# Altium schematic sheet npm1300_qeaa_config4.SchDoc: nPM1300-QEAA Ref. Layout Config. 4
size A4; Revision: 1.2; SheetNumber: 1; SheetTotal: 1; DrawnBy: EISK; DocumentSize: A4; BoardTitle: nPM1300-QEAA Ref. Layout Config. 4; PCAName: nPM1300-QEAA; RefLayoutTitle: Full + High frequency decoupling; Device: nPM1300-QEAA; Classification: PUBLIC; Config: 4
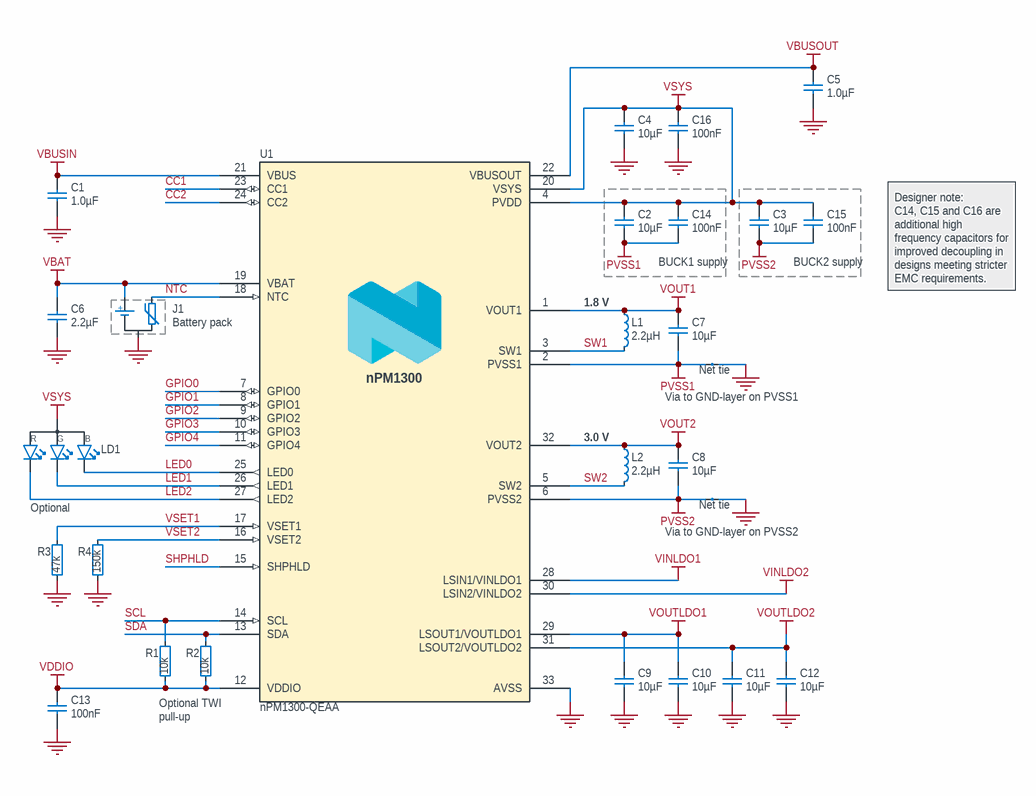
[diagram p0: npm1300_qeaa_config4.SchDoc]

## Parts
C1  1.0µF  [CAPC1608X06L]
C2  10µF  [CAPC1608X06L]
C3  10µF  [CAPC1608X06L]
C4  10µF  [CAPC1608X06L]
C5  1.0µF  [CAPC1608X06L]
C6  2.2µF  [CAPC1608X06L]
C7  10µF  [CAPC1608X06L]
C8  10µF  [CAPC1608X06L]
C9  10µF  [CAPC1608X06L]
C10  10µF  [CAPC1608X06L]
C11  10µF  [CAPC1608X06L]
C12  10µF  [CAPC1608X06L]
C13  100nF  [CAPC0603X03L_C]
C14  100nF  [CAPC1005X04L]
C15  100nF  [CAPC1005X04L]
C16  100nF  [CAPC1005X04L]
J1  Battery pack  [TP_3x1mm_TH]  (graphical)
L1  2.2µH  [INDC2016X10N]
L2  2.2µH  [INDC2016X10N]
LD1  LED RGB  [LED_RGB_0603]  (value not drawn)  (graphical)
NT1  Net tie  [2 PIN STARPOINT]  (net tie, no BOM)
NT2  Net tie  [2 PIN STARPOINT]  (net tie, no BOM)
R1  10k  [RESC0603X03L_C]
R2  10k  [RESC0603X03L_C]
R3  47k  [RESC0603X03L_C]
R4  150k  [RESC0603X03L_C]
U1  nPM1300-QEAA  [Nordic_QFN50P500X500X90-33N]

## Blocks framed on the sheet
BUCK1 supply: C2 C14
BUCK2 supply: C3 C15

## Nets
GND: C1.1 C4.1 C5.1 C6.1 C9.1 C10.1 C11.1 C12.1 C13.2 C16.2 J1.1(GND) NT1.1 NT2.1 R3.2 R4.2 U1.33(AVSS)
PVSS1: C2.1 C7.1 C14.2 NT1.2 U1.2(PVSS1)
PVSS2: C3.1 C8.1 C15.2 NT2.2 U1.6(PVSS2)
VBAT: C6.2 J1.3(V+) U1.19(VBAT)
VBUSIN: C1.2 U1.21(VBUS)
VBUSOUT: C5.2 U1.22(VBUSOUT)
VDDIO: C13.1 R1.2 R2.2 U1.12(VDDIO)
VINLDO1: U1.28(LSIN1/VINLDO1)
VINLDO2: U1.30(LSIN2/VINLDO2)
VOUT1: C7.2 L1.1 U1.1(VOUT1)
VOUT2: C8.2 L2.1 U1.32(VOUT2)
VOUTLDO1: C9.2 C10.2 U1.29(LSOUT1/VOUTLDO1)
VOUTLDO2: C11.2 C12.2 U1.31(LSOUT2/VOUTLDO2)
VSYS: C2.2 C3.2 C4.2 C14.1 C15.1 C16.1 LD1.4(A) U1.4(PVDD) U1.20(VSYS)
CC1: U1.23(CC1)
CC2: U1.24(CC2)
GPIO0: U1.7(GPIO0)
GPIO1: U1.8(GPIO1)
GPIO2: U1.9(GPIO2)
GPIO3: U1.10(GPIO3)
GPIO4: U1.11(GPIO4)
LED0: LD1.3(C_BLUE) U1.25(LED0)
LED1: LD1.2(C_GREEN) U1.26(LED1)
LED2: LD1.1(C_RED) U1.27(LED2)
NTC: J1.2(NTC) U1.18(NTC)
SCL: R1.1 U1.14(SCL)
SDA: R2.1 U1.13(SDA)
SHPHLD: U1.15(SHPHLD)
SW1: L1.2 U1.3(SW1)
SW2: L2.2 U1.5(SW2)
VSET1: R3.1 U1.17(VSET1)
VSET2: R4.1 U1.16(VSET2)

## Notes on the sheet
- (near L1) 1.8 V
- Designer note:
  C14, C15 and C16 are additional high frequency capacitors for improved decoupling in designs meeting stricter EMC requirements.
- (near L2) 3.0 V
- (near NT1) Via to GND-layer on PVSS1
- Optional LEDs
- (near NT2) Via to GND-layer on PVSS2
- Optional TWI pull-up resistors
- Title
- Size
- Date:
- File:
- A4
- Config. No.
- Device
- Sheet
- Drawn By:
- Revision
- of
- Nordic Semiconductor does not warrant the accuracy or completeness of this documentation or any included information. Nordic Semiconductor makes no assurances that this design will meet specification, be appropriate for your application, or fit for any particular purpose, or that it will function in an implementation. Nordic Semiconductor also does not claim that the design is ready for production. It is your responsibility to thoroughly validate and test your design implementation to confirm the functionality of your application.
  © Nordic Semiconductor — All rights reserved.
- Classification:
- (in symbol APHF1608LSEEQBDZGKC) R; G; B
- (in symbol Battery_w/NTC_TP) +
- (in symbol nPM1300-QEAA) nPM1300

## Library data of the parts
C1 = C0603-1µ0-10V-X5R: Capacitor, Ceramic, 1.0µF 10V X5R 0603,±10%; Manufacturer: N.A.; Part number NEMS: 100200528; Pad Count: 2; Component Status: Active; Part Number: C0603-1µ0-10V-X5R; Manufacturer Part Number: N.A.; Footprint Doc: 0603; LatestRevisionDate: 2022-10-06; Published: 2022-10-06; Value: 1.0µF; Note: 10V; Artikkelnr Noca: N.A.; Part number IPS: N.A.; ComponentLink1URL: N.A.; ComponentLink1Description: Datasheet; ComponentLink2URL: N.A.; ComponentLink2Description: Supplier link; HelpURL: N.A.; Supplier 1: N.A.; Supplier Part Number 1: N.A.; Supplier 2: N.A.; Supplier Part Number 2: N.A.; Component Class: Capacitors; PartId: 100200528; Author: getr; Part number Norautron: N.A.
C2-C4 C7-C12 = C0603-10µ: Capacitor, X5R, ±20%; Manufacturer: N.A.; Part number IPS: 00000007785; Part number NEMS: 100200275; Note: 6.3V; Artikkelnr Noca: 20039234; Pad Count: 2; Component Status: Active; Part Number: C0603-10µ; Manufacturer Part Number: N.A.; ComponentLink1URL: N.A.; ComponentLink1Description: Datasheet; ComponentLink2URL: N.A.; ComponentLink2Description: Supplier link; HelpURL: N.A.; Footprint Doc: 0603; LatestRevisionDate: 2011-01-17; Published: 2011-01-17; Value: 10µF; Supplier 1: N.A.; Supplier Part Number 1: N.A.; Supplier 2: N.A.; Supplier Part Number 2: N.A.; Component Class: Capacitors; PartId: 100200275; Author: rsk; Part number Norautron: N.A.
C5 = C0603-1µ0-10V-X5R: Capacitor, Ceramic, 1.0µF 10V X5R 0603,±10%; Manufacturer: N.A.; Part number NEMS: 100200528; Component Status: Active; Pad Count: 2; Part Number: C0603-1µ0-10V-X5R; PartId: 100200528; Component Class: Capacitors; Author: getr; Manufacturer Part Number: N.A.; ComponentLink1URL: N.A.; ComponentLink1Description: Datasheet; ComponentLink2URL: N.A.; ComponentLink2Description: Supplier link; HelpURL: N.A.; LatestRevisionDate: 2022-10-06; Published: 2022-10-06; Footprint Doc: 0603; Value: 1.0µF; Note: 10V; Supplier 1: N.A.; Supplier Part Number 1: N.A.; Supplier 2: N.A.; Supplier Part Number 2: N.A.; Artikkelnr Noca: N.A.; Part number IPS: N.A.; Part number Norautron: N.A.
C6 = C0603-2.2µ-16V-X7R: Capacitor, Ceramic, X7R, ±10%, 16V; Manufacturer: Taiyo Yuden; Manufacturer Part Number: EMK107BB7225KA-T; Part number NEMS: 100200439; Component Status: Active; Pad Count: 2; Artikkelnr Noca: N.A.; Part Number: C0603-2.2µ-16V-X7R; PartId: 100200439; Component Class: Capacitors; Author: rsk; ComponentLink1URL: https://ds.yuden.co.jp/TYCOMPAS/ut/specSheet?pn=EMK107BB7225KA-T; ComponentLink1Description: Datasheet; ComponentLink2URL: https://ds.yuden.co.jp/TYCOMPAS/ut/detail?pn=EMK107BB7225KA-T&u=M; ComponentLink2Description: Supplier link; HelpURL: https://www.digikey.no/product-detail/en/taiyo-yuden/EMK107BB7225KA-T/587-5835-2-ND/4970646; LatestRevisionDate: 2020-10-13; Published: 2020-02-03; Footprint Doc: 0603; Value: 2.2µF; Note: 16V; Supplier 1: Digi-Key; Supplier Part Number 1: 587-5835-2-ND; Supplier 2: N.A.; Supplier Part Number 2: N.A.; Part number IPS: N.A.; Part number Norautron: N.A.
C13 = C0201-100n: Capacitor, X5R, ±10%, 100nF, 16V; Manufacturer: N.A.; Part number IPS: 00000001248, 00000002505; Part number Norautron: 262071862; Part number NEMS: 100200078; Pad Count: 2; Component Status: Active; Part Number: C0201-100n; PartId: 100200078; Component Class: Capacitors; Author: rsk; Manufacturer Part Number: N.A.; ComponentLink1URL: N.A.; ComponentLink1Description: Datasheet; ComponentLink2URL: N.A.; ComponentLink2Description: Supplier link; HelpURL: N.A.; Footprint Doc: 0201; LatestRevisionDate: 2024-06-27; Published: 2014-11-13; Value: 100nF; Note: 16V; Supplier 1: N.A.; Supplier Part Number 1: N.A.; Supplier 2: N.A.; Supplier Part Number 2: N.A.; Artikkelnr Noca: N.A.
C14-C16 = C0402-100n-16V-X7R-C0402C104M4RAC7867: Capacitor, Ceramic, X7R, ±20%, 16V; Manufacturer: Kemet; Part number NEMS: 100200504; Component Status: Active; Pad Count: 2; Artikkelnr Noca: N.A.; Part Number: C0402-100n-16V-X7R-C0402C104M4RAC7867; PartId: 100200504; Component Class: Capacitors; Author: getr; Manufacturer Part Number: C0402C104M4RAC7867; ComponentLink1URL: https://api.kemet.com/component-edge/download/datasheet/C0402C104M4RACTU.pdf; ComponentLink1Description: Datasheet; ComponentLink2URL: https://www.digikey.no/no/products/detail/kemet/C0402C104M4RAC7867/2196240?s=N4IgTCBcDaIMIAYAsCxwIzILJIEoEE4B2ADgDYiQBdAXyA; ComponentLink2Description: Supplier link; HelpURL: https://www.kemet.com/en/us/capacitors/ceramic/kc-link/product/C0402C104M4RACTU.html; LatestRevisionDate: 2024-03-23; Published: 2022-03-23; Footprint Doc: 0402; Value: 100nF; Note: 16V; Supplier 1: Digi-Key; Supplier Part Number 1: 399-C0402C104M4RAC7867CT-ND; Supplier 2: N.A.; Supplier Part Number 2: N.A.; Part number IPS: N.A.; Part number Norautron: N.A.
J1 = Battery_w/NTC_TP: Battery pack with NTC; Manufacturer: N.A.; Part number NEMS: 101800005; Pad Count: 3; Component Status: Active; Footprint Doc: TP_3x1mm_TH; Value: Battery pack; Component Class: Batteries; Author: rsk; Part Number: Battery_w/NTC_TP; PartId: 101800005; Manufacturer Part Number: N.A.; ComponentLink1URL: N.A.; ComponentLink1Description: Datasheet; ComponentLink2URL: N.A.; ComponentLink2Description: Supplier link; HelpURL: N.A.; LatestRevisionDate: 2020-09-21; Published: 2020-09-21; Note: N.A.; Supplier 1: N.A.; Supplier Part Number 1: N.A.; Supplier 2: N.A.; Supplier Part Number 2: N.A.; Artikkelnr Noca: N.A.; Part number IPS: N.A.; Part number Norautron: N.A.
L1 L2 = L0806-2µ2-2500mA-73mOhm-CIGT201610EH2R2MNE: Inductor, Irms=2.5A, Isat=2.9A, ±20%, DCR=73mΩ; Manufacturer: Samsung Electro-Mechanics America; Part number Norautron: 26521789; Part number NEMS: 100300400; Pad Count: 2; Note: Unshielded Thin Film Inductor; Artikkelnr Noca: N.A.; Component Status: Active; Part Number: L0806-2µ2-2500mA-73mOhm-CIGT201610EH2R2MNE; PartId: 100300400; Component Class: Inductors; Author: rsk; Manufacturer Part Number: CIGT201610EH2R2MNE; ComponentLink1URL: https://media.digikey.com/pdf/Data%20Sheets/Samsung%20PDFs/CIGT201610EH2R2MNE_Spec.pdf; ComponentLink1Description: Datasheet; ComponentLink2URL: https://www.digikey.com/en/products/detail/samsung-electro-mechanics/CIGT201610EH2R2MNE/7041223?s=N4IgTCBcDaIMIEkDiAVMAGAjANk%2BgogBJgBKYAsgHL4gC6AvkA; ComponentLink2Description: Supplier link; HelpURL: http://product.samsungsem.com/pi/CIGT201610EH2R2MN.do; Footprint Doc: 0806; LatestRevisionDate: 2022-09-07; Published: 2021-02-03; Value: 2.2µH; Supplier 1: Digi-Key; Supplier Part Number 1: 1276-6901-1-ND; Supplier 2: Mouser; Supplier Part Number 2: 187-CIGT201610EH2R2M; Part number IPS: N.A.
LD1 = APHF1608LSEEQBDZGKC: RGB LED 1.60 mm x 0.80 mm SMD; Manufacturer: Kingbright Company LLC; Part number IPS: 00000001254; Part number Norautron: 26470023; Part number NEMS: 101400123; Pad Count: 4; Note: N.A.; Component Status: Active; Part Number: APHF1608LSEEQBDZGKC; PartId: 101400123; Component Class: Optoelectronics; Author: rsk; Manufacturer Part Number: APHF1608LSEEQBDZGKC; ComponentLink1URL: N.A.; ComponentLink1Description: Datasheet; ComponentLink2URL: N.A.; ComponentLink2Description: Supplier link; HelpURL: http://www.kingbrightusa.com/images/catalog/SPEC/APHF1608LSEEQBDZGKC.pdf; Footprint Doc: LED_RGB_0603; LatestRevisionDate: 2017-11-09; Published: 2017-09-18; Value: LED RGB; Supplier 1: Digi-Key; Supplier Part Number 1: 754-2143-1-ND; Supplier 2: N.A.; Supplier Part Number 2: N.A.; Artikkelnr Noca: N.A.
NT1 NT2 = 2 pin starpoint: Starpoint; Manufacturer: N.A.; Part number NEMS: 100500603; Pad Count: 2; Component Status: Active; Part Number: 2 pin starpoint; Manufacturer Part Number: N.A.; ComponentLink1URL: N.A.; ComponentLink1Description: Datasheet; ComponentLink2URL: N.A.; ComponentLink2Description: Supplier link; HelpURL: N.A.; Footprint Doc: N.A.; LatestRevisionDate: 2017-08-31; Published: 2017-08-31; Value: Net tie; Note: N.A.; Supplier 1: N.A.; Supplier Part Number 1: N.A.; Supplier 2: N.A.; Supplier Part Number 2: N.A.; Artikkelnr Noca: N.A.; Part number IPS: N.A.; Component Class: Connectors; PartId: 100500603; Author: rsk; Part number Norautron: N.A.
R1 R2 = R0201-10k: Resistor, ±1%, 0.05W; Manufacturer: N.A.; Part number IPS: 00000001255; Part number Norautron: 26107101; Part number NEMS: 100100065; Pad Count: 2; Note: Chip Res 1%; Component Status: Active; Part Number: R0201-10k; PartId: 100100065; Component Class: Resistors; Author: rsk; Manufacturer Part Number: N.A.; ComponentLink1URL: N.A.; ComponentLink1Description: Datasheet; ComponentLink2URL: N.A.; ComponentLink2Description: Supplier link; HelpURL: N.A.; Footprint Doc: 0201; LatestRevisionDate: 2014-11-13; Published: 2014-11-13; Value: 10k; Supplier 1: N.A.; Supplier Part Number 1: N.A.; Supplier 2: N.A.; Supplier Part Number 2: N.A.; Artikkelnr Noca: N.A.
R3 = R0201-47k: Resistor, ±1%, 0.05W; Manufacturer: N.A.; Part number IPS: 00000001423; Part number NEMS: 100100076; Component Status: Active; Pad Count: 2; Note: Chip Res 1%; Part Number: R0201-47k; PartId: 100100076; Component Class: Resistors; Author: rsk; Manufacturer Part Number: N.A.; ComponentLink1URL: N.A.; ComponentLink1Description: Datasheet; ComponentLink2URL: N.A.; ComponentLink2Description: Supplier link; HelpURL: N.A.; LatestRevisionDate: 2014-11-13; Published: 2014-11-13; Footprint Doc: 0201; Value: 47k; Supplier 1: N.A.; Supplier Part Number 1: N.A.; Supplier 2: N.A.; Supplier Part Number 2: N.A.; Artikkelnr Noca: N.A.; Part number Norautron: N.A.
R4 = R0201-150k: Resistor, ±1%, 0.05W; Manufacturer: N.A.; Part number IPS: 00000001422; Part number NEMS: 100100082; Component Status: Active; Pad Count: 2; Note: Chip Res 1%; Part Number: R0201-150k; PartId: 100100082; Component Class: Resistors; Author: rsk; Manufacturer Part Number: N.A.; ComponentLink1URL: N.A.; ComponentLink1Description: Datasheet; ComponentLink2URL: N.A.; ComponentLink2Description: Supplier link; HelpURL: N.A.; LatestRevisionDate: 2014-11-13; Published: 2014-11-13; Footprint Doc: 0201; Value: 150k; Supplier 1: N.A.; Supplier Part Number 1: N.A.; Supplier 2: N.A.; Supplier Part Number 2: N.A.; Artikkelnr Noca: N.A.; Part number Norautron: N.A.
U1 = nPM1300-QEAA: Li-Ion/Li-Polymer USB-C battery charger with high efficiency buck regulators, LDOs or load switches, LED drivers, TWI and VBUSOUT; Manufacturer: Nordic Semiconductor; Part number NEMS: 102000291; Component Status: Active; Pad Count: 33; Note: N.A.; Part Number: nPM1300-QEAA; PartId: 102000291; Component Class: Nordic_Devices; Author: eisk; Manufacturer Part Number: nPM1300-QEAA; ComponentLink1URL: N.A.; ComponentLink1Description: Datasheet; ComponentLink2URL: N.A.; ComponentLink2Description: Supplier link; HelpURL: N.A.; LatestRevisionDate: 2023-05-25; Published: 2022-02-17; Footprint Doc: QFN-32; Value: nPM1300-QEAA; Supplier 1: Nordic Semiconductor; Supplier Part Number 1: nPM1300-QEAA; Supplier 2: N.A.; Supplier Part Number 2: N.A.; Artikkelnr Noca: N.A.; Part number IPS: N.A.; Part number Norautron: N.A.